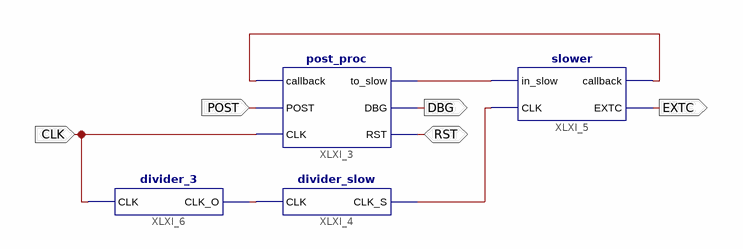
[diagram p0: schematic sheet 1]
// Xilinx ISE schematic overall.sch (xbr) as structural Verilog: 4 symbols, 5 ports
module overall (
  input  POST,
  input  CLK,
  inout  RST,
  output DBG,
  output EXTC
);

  wire XLXN_6, XLXN_11, XLXN_42, XLXN_48;

  post_proc XLXI_3 (.CLK(CLK), .to_slow(XLXN_6), .DBG(DBG), .RST(RST), .POST(POST), .callback(XLXN_11));
  divider_slow XLXI_4 (.CLK(XLXN_48), .CLK_S(XLXN_42));
  slower XLXI_5 (.CLK(XLXN_42), .in_slow(XLXN_6), .EXTC(EXTC), .callback(XLXN_11));
  divider_3 XLXI_6 (.CLK(CLK), .CLK_O(XLXN_48));
endmodule
